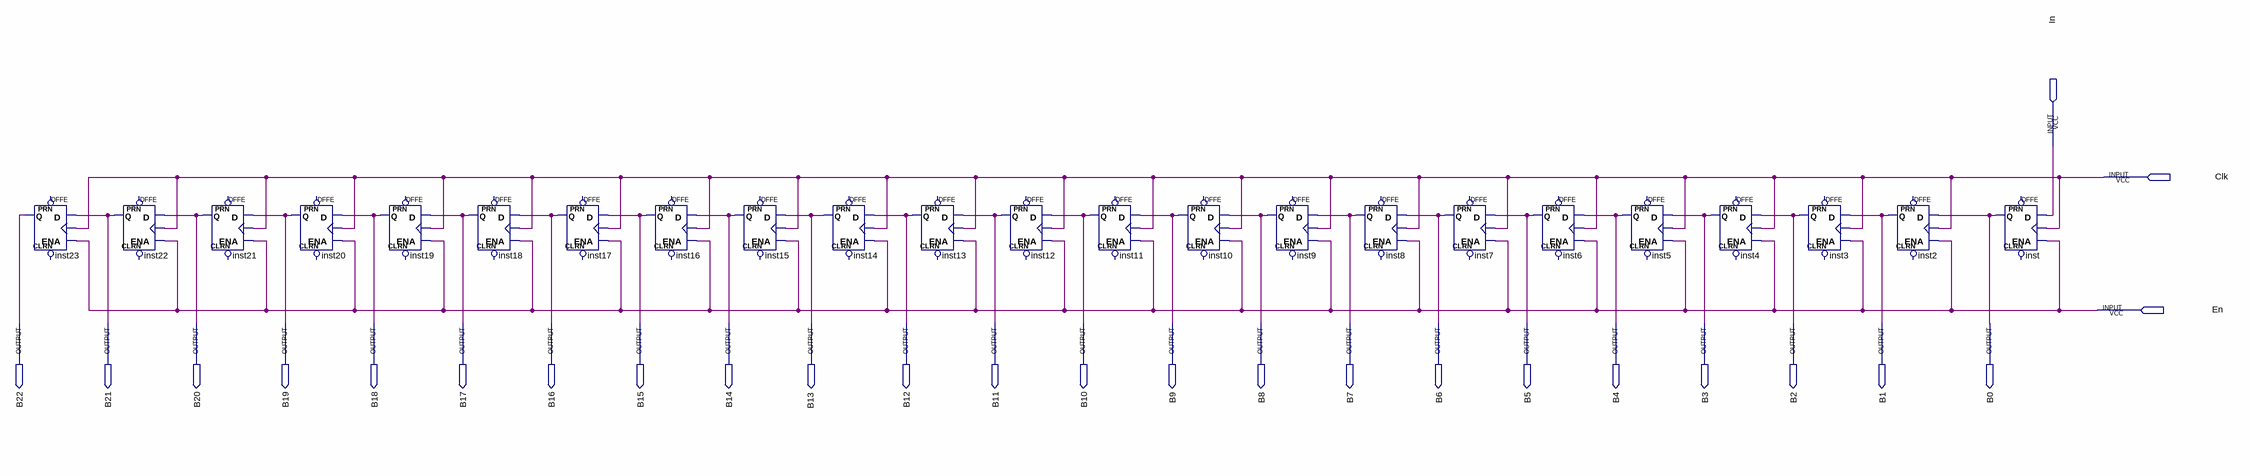
[diagram p0: schematic sheet]
// Quartus schematic 23_bit_shift_reg.bdf as structural Verilog: 23 symbols, 26 pins
module \23_bit_shift_reg  (
  input  In,
  input  Clk,
  input  En,
  output B22,
  output B21,
  output B20,
  output B19,
  output B18,
  output B17,
  output B16,
  output B15,
  output B14,
  output B13,
  output B12,
  output B11,
  output B10,
  output B9,
  output B8,
  output B7,
  output B6,
  output B5,
  output B4,
  output B3,
  output B2,
  output B1,
  output B0
);

  DFFE inst23 (.D(B21), .CLK(Clk), .ENA(En), .Q(B22));  // open: PRN, CLRN
  DFFE inst22 (.D(B20), .CLK(Clk), .ENA(En), .Q(B21));  // open: PRN, CLRN
  DFFE inst21 (.D(B19), .CLK(Clk), .ENA(En), .Q(B20));  // open: PRN, CLRN
  DFFE inst20 (.D(B18), .CLK(Clk), .ENA(En), .Q(B19));  // open: PRN, CLRN
  DFFE inst19 (.D(B17), .CLK(Clk), .ENA(En), .Q(B18));  // open: PRN, CLRN
  DFFE inst18 (.D(B16), .CLK(Clk), .ENA(En), .Q(B17));  // open: PRN, CLRN
  DFFE inst17 (.D(B15), .CLK(Clk), .ENA(En), .Q(B16));  // open: PRN, CLRN
  DFFE inst16 (.D(B14), .CLK(Clk), .ENA(En), .Q(B15));  // open: PRN, CLRN
  DFFE inst15 (.D(B13), .CLK(Clk), .ENA(En), .Q(B14));  // open: PRN, CLRN
  DFFE inst14 (.D(B12), .CLK(Clk), .ENA(En), .Q(B13));  // open: PRN, CLRN
  DFFE inst13 (.D(B11), .CLK(Clk), .ENA(En), .Q(B12));  // open: PRN, CLRN
  DFFE inst12 (.D(B10), .CLK(Clk), .ENA(En), .Q(B11));  // open: PRN, CLRN
  DFFE inst11 (.D(B9), .CLK(Clk), .ENA(En), .Q(B10));  // open: PRN, CLRN
  DFFE inst10 (.D(B8), .CLK(Clk), .ENA(En), .Q(B9));  // open: PRN, CLRN
  DFFE inst9 (.D(B7), .CLK(Clk), .ENA(En), .Q(B8));  // open: PRN, CLRN
  DFFE inst8 (.D(B6), .CLK(Clk), .ENA(En), .Q(B7));  // open: PRN, CLRN
  DFFE inst7 (.D(B5), .CLK(Clk), .ENA(En), .Q(B6));  // open: PRN, CLRN
  DFFE inst6 (.D(B4), .CLK(Clk), .ENA(En), .Q(B5));  // open: PRN, CLRN
  DFFE inst5 (.D(B3), .CLK(Clk), .ENA(En), .Q(B4));  // open: PRN, CLRN
  DFFE inst4 (.D(B2), .CLK(Clk), .ENA(En), .Q(B3));  // open: PRN, CLRN
  DFFE inst3 (.D(B1), .CLK(Clk), .ENA(En), .Q(B2));  // open: PRN, CLRN
  DFFE inst2 (.D(B0), .CLK(Clk), .ENA(En), .Q(B1));  // open: PRN, CLRN
  DFFE inst (.D(In), .CLK(Clk), .ENA(En), .Q(B0));  // open: PRN, CLRN
endmodule
